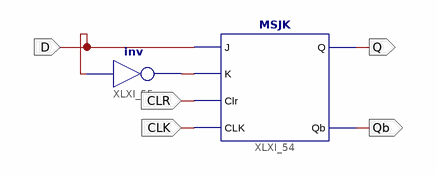
[diagram p0: schematic sheet 1]
// Xilinx ISE schematic D_FF.sch (spartan3a) as structural Verilog: 2 symbols, 5 ports
module D_FF (
  input  D,
  input  CLR,
  input  CLK,
  output Qb,
  output Q
);

  wire XLXN_104;

  MSJK XLXI_54 (.J(D), .K(XLXN_104), .Clr(CLR), .CLK(CLK), .Q(Q), .Qb(Qb));
  not XLXI_55 (XLXN_104, D);
endmodule
